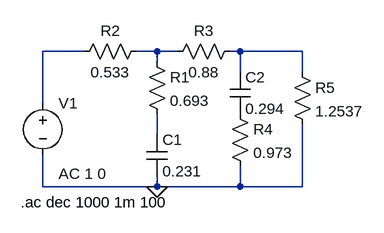
[diagram p0: schematic ej1.asc]
ej1.asc, the LTspice schematic file:
Version 4
SHEET 1 880 680
WIRE 96 48 32 48
WIRE 208 48 176 48
WIRE 240 48 208 48
WIRE 336 48 320 48
WIRE 432 48 336 48
WIRE 208 64 208 48
WIRE 336 80 336 48
WIRE 432 80 432 48
WIRE 32 128 32 48
WIRE 208 176 208 144
WIRE 32 256 32 208
WIRE 208 256 208 240
WIRE 208 256 32 256
WIRE 336 256 336 224
WIRE 336 256 208 256
WIRE 432 256 432 160
WIRE 432 256 336 256
FLAG 208 256 0
SYMBOL voltage 32 112 R0
WINDOW 123 24 124 Left 2
WINDOW 39 0 0 Left 0
SYMATTR InstName V1
SYMATTR Value ""
SYMATTR Value2 AC 1 0
SYMBOL res 192 48 R0
SYMATTR InstName R1
SYMATTR Value 0.693
SYMBOL cap 192 176 R0
SYMATTR InstName C1
SYMATTR Value 0.231
SYMBOL res 80 64 R270
WINDOW 0 32 56 VTop 2
WINDOW 3 0 56 VBottom 2
SYMATTR InstName R2
SYMATTR Value 0.533
SYMBOL res 224 64 R270
WINDOW 0 32 56 VTop 2
WINDOW 3 0 56 VBottom 2
SYMATTR InstName R3
SYMATTR Value 0.88
SYMBOL res 320 128 R0
SYMATTR InstName R4
SYMATTR Value 0.973
SYMBOL cap 320 80 R0
SYMATTR InstName C2
SYMATTR Value 0.294
SYMBOL res 416 64 R0
SYMATTR InstName R5
SYMATTR Value 1.2537
TEXT -2 280 Left 2 !.ac dec 1000 1m 100

The netlist it stands for:
* ej1.asc
V1 N001 0 AC 1 0
R1 N002 N004 0.693
C1 N004 0 0.231
R2 N001 N002 0.533
R3 N002 N003 0.88
R4 P001 0 0.973
C2 N003 P001 0.294
R5 N003 0 1.2537
.ac dec 1000 1m 100
.backanno
.end